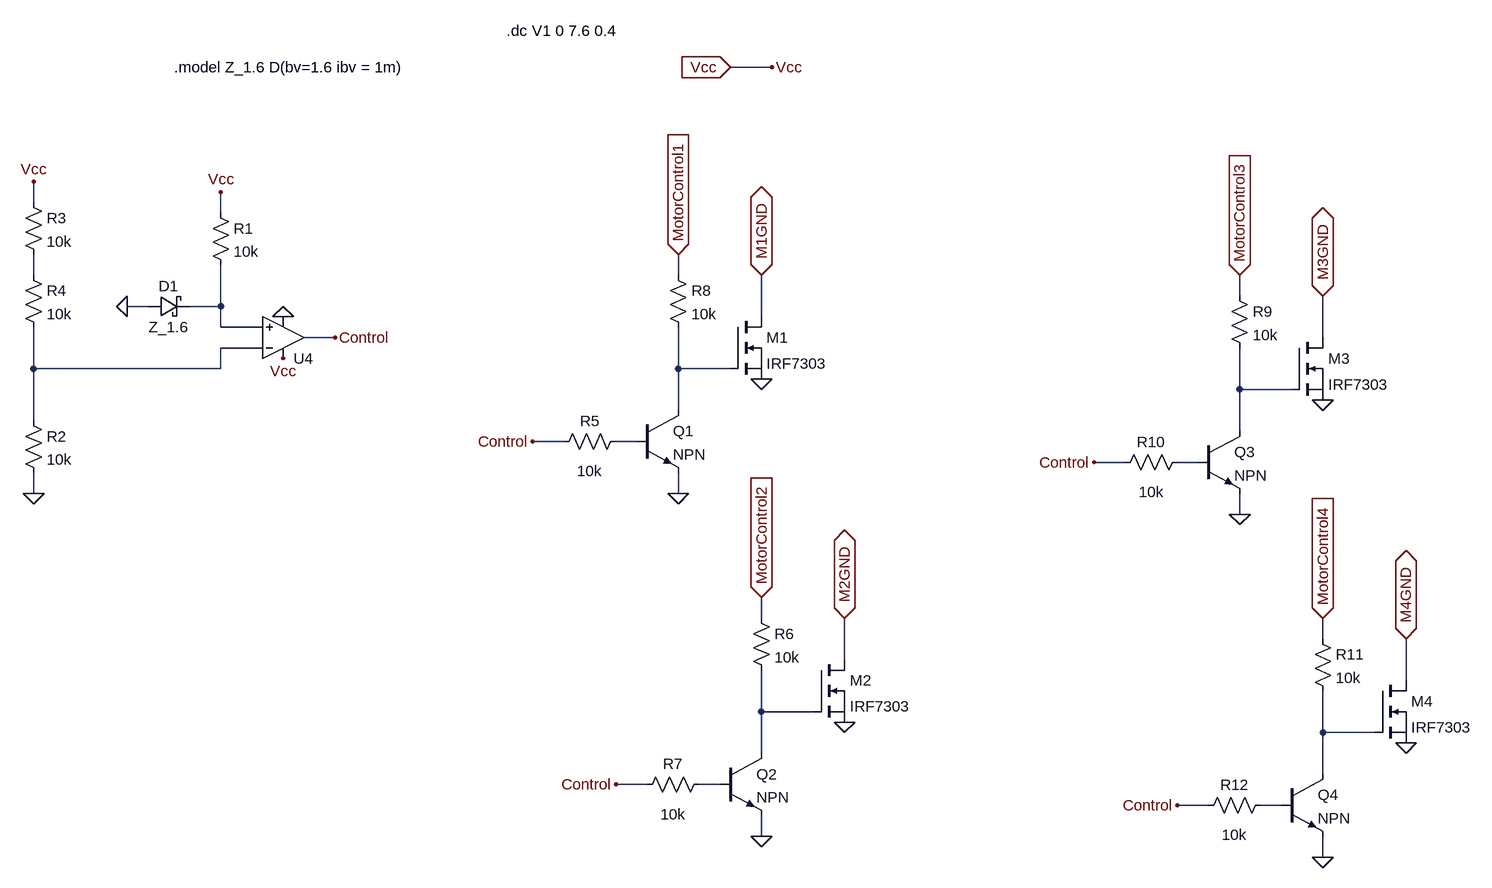
[diagram p0: schematic DC_Motor_Controller.asc]
DC_Motor_Controller.asc, the LTspice schematic file:
Version 4
SHEET 1 2256 1204
WIRE 1168 -32 1104 -32
WIRE 32 176 32 144
WIRE 320 192 320 160
WIRE 32 288 32 256
WIRE 1024 288 1024 256
WIRE 1888 320 1888 288
WIRE 208 336 176 336
WIRE 320 336 320 272
WIRE 320 336 272 336
WIRE 1152 352 1152 288
WIRE 320 368 320 336
WIRE 384 368 320 368
WIRE 496 384 448 384
WIRE 2016 384 2016 320
WIRE 384 400 320 400
WIRE 32 432 32 368
WIRE 320 432 320 400
WIRE 320 432 32 432
WIRE 1024 432 1024 368
WIRE 1104 432 1024 432
WIRE 1888 464 1888 400
WIRE 1968 464 1888 464
WIRE 1024 496 1024 432
WIRE 32 512 32 432
WIRE 1888 528 1888 464
WIRE 848 544 800 544
WIRE 960 544 928 544
WIRE 1712 576 1664 576
WIRE 1824 576 1792 576
WIRE 32 624 32 592
WIRE 1024 624 1024 592
WIRE 1888 656 1888 624
WIRE 1152 816 1152 784
WIRE 2016 848 2016 816
WIRE 1280 880 1280 816
WIRE 2144 912 2144 848
WIRE 1152 960 1152 896
WIRE 1232 960 1152 960
WIRE 2016 992 2016 928
WIRE 2096 992 2016 992
WIRE 1152 1024 1152 960
WIRE 2016 1056 2016 992
WIRE 976 1072 928 1072
WIRE 1088 1072 1056 1072
WIRE 1840 1104 1792 1104
WIRE 1952 1104 1920 1104
WIRE 1152 1152 1152 1120
WIRE 2016 1184 2016 1152
FLAG 176 336 0
FLAG 32 624 0
FLAG 416 352 0
FLAG 32 144 Vcc
FLAG 320 160 Vcc
FLAG 1152 448 0
FLAG 416 416 Vcc
FLAG 1024 624 0
FLAG 800 544 Control
FLAG 496 384 Control
FLAG 1104 -32 Vcc
IOPIN 1104 -32 In
FLAG 1168 -32 Vcc
FLAG 1024 256 MotorControl1
IOPIN 1024 256 In
FLAG 1152 288 M1GND
IOPIN 1152 288 BiDir
FLAG 1280 976 0
FLAG 1152 1152 0
FLAG 928 1072 Control
FLAG 1152 784 MotorControl2
IOPIN 1152 784 In
FLAG 1280 816 M2GND
IOPIN 1280 816 BiDir
FLAG 2016 480 0
FLAG 1888 656 0
FLAG 1664 576 Control
FLAG 1888 288 MotorControl3
IOPIN 1888 288 In
FLAG 2016 320 M3GND
IOPIN 2016 320 BiDir
FLAG 2144 1008 0
FLAG 2016 1184 0
FLAG 1792 1104 Control
FLAG 2016 816 MotorControl4
IOPIN 2016 816 In
FLAG 2144 848 M4GND
IOPIN 2144 848 BiDir
SYMBOL res 304 176 R0
SYMATTR InstName R1
SYMATTR Value 10k
SYMBOL res 16 496 R0
SYMATTR InstName R2
SYMATTR Value 10k
SYMBOL nmos 1104 352 R0
SYMATTR InstName M1
SYMATTR Value IRF7303
SYMBOL res 16 160 R0
SYMATTR InstName R3
SYMATTR Value 10k
SYMBOL res 16 272 R0
SYMATTR InstName R4
SYMATTR Value 10k
SYMBOL res 1008 272 R0
SYMATTR InstName R8
SYMATTR Value 10k
SYMBOL npn 960 496 R0
SYMATTR InstName Q1
SYMBOL schottky 208 352 R270
WINDOW 0 32 32 VTop 2
WINDOW 3 0 32 VBottom 2
SYMATTR InstName D1
SYMATTR Value Z_1.6
SYMBOL OpAmps\\UniversalOpAmp2 416 384 M180
SYMATTR InstName U4
SYMBOL res 944 528 R90
WINDOW 0 0 56 VBottom 2
WINDOW 3 46 56 VTop 2
SYMATTR InstName R5
SYMATTR Value 10k
SYMBOL nmos 1232 880 R0
SYMATTR InstName M2
SYMATTR Value IRF7303
SYMBOL res 1136 800 R0
SYMATTR InstName R6
SYMATTR Value 10k
SYMBOL npn 1088 1024 R0
SYMATTR InstName Q2
SYMBOL res 1072 1056 R90
WINDOW 0 0 56 VBottom 2
WINDOW 3 46 56 VTop 2
SYMATTR InstName R7
SYMATTR Value 10k
SYMBOL nmos 1968 384 R0
SYMATTR InstName M3
SYMATTR Value IRF7303
SYMBOL res 1872 304 R0
SYMATTR InstName R9
SYMATTR Value 10k
SYMBOL npn 1824 528 R0
SYMATTR InstName Q3
SYMBOL res 1808 560 R90
WINDOW 0 0 56 VBottom 2
WINDOW 3 46 56 VTop 2
SYMATTR InstName R10
SYMATTR Value 10k
SYMBOL nmos 2096 912 R0
SYMATTR InstName M4
SYMATTR Value IRF7303
SYMBOL res 2000 832 R0
SYMATTR InstName R11
SYMATTR Value 10k
SYMBOL npn 1952 1056 R0
SYMATTR InstName Q4
SYMBOL res 1936 1088 R90
WINDOW 0 0 56 VBottom 2
WINDOW 3 46 56 VTop 2
SYMATTR InstName R12
SYMATTR Value 10k
TEXT 760 -88 Left 2 !.dc V1 0 7.6 0.4
TEXT 248 -32 Left 2 !.model Z_1.6 D(bv=1.6 ibv = 1m)

The netlist it stands for:
* DC_Motor_Controller.asc
R1 Vcc N002 10k
R2 N003 0 10k
M1 M1GND N004 0 0 IRF7303
R3 Vcc N001 10k
R4 N001 N003 10k
R8 MotorControl1 N004 10k
Q1 N004 N006 0 0 NPN
D1 0 N002 Z_1.6
XU4 N002 N003 Vcc 0 Control level2 Avol=1Meg GBW=10Meg Slew=10Meg Ilimit=25m Rail=0 Vos=0 En=0 Enk=0 In=0 Ink=0 Rin=500Meg  ; pins In+ In- V+ V- OUT
R5 N006 Control 10k
M2 M2GND N008 0 0 IRF7303
R6 MotorControl2 N008 10k
Q2 N008 N010 0 0 NPN
R7 N010 Control 10k
M3 M3GND N005 0 0 IRF7303
R9 MotorControl3 N005 10k
Q3 N005 N007 0 0 NPN
R10 N007 Control 10k
M4 M4GND N009 0 0 IRF7303
R11 MotorControl4 N009 10k
Q4 N009 N011 0 0 NPN
R12 N011 Control 10k
.model D D
.lib standard.dio
.model NPN NPN
.model PNP PNP
.lib standard.bjt
.model NMOS NMOS
.model PMOS PMOS
.lib standard.mos
.dc V1 0 7.6 0.4
.model Z_1.6 D(bv=1.6 ibv = 1m)
.lib UniversalOpAmp2.lib
.backanno
.end